# EAGLE schematic MGC3130_Board (EAGLE 6.3)

## Sheet 1 of 2
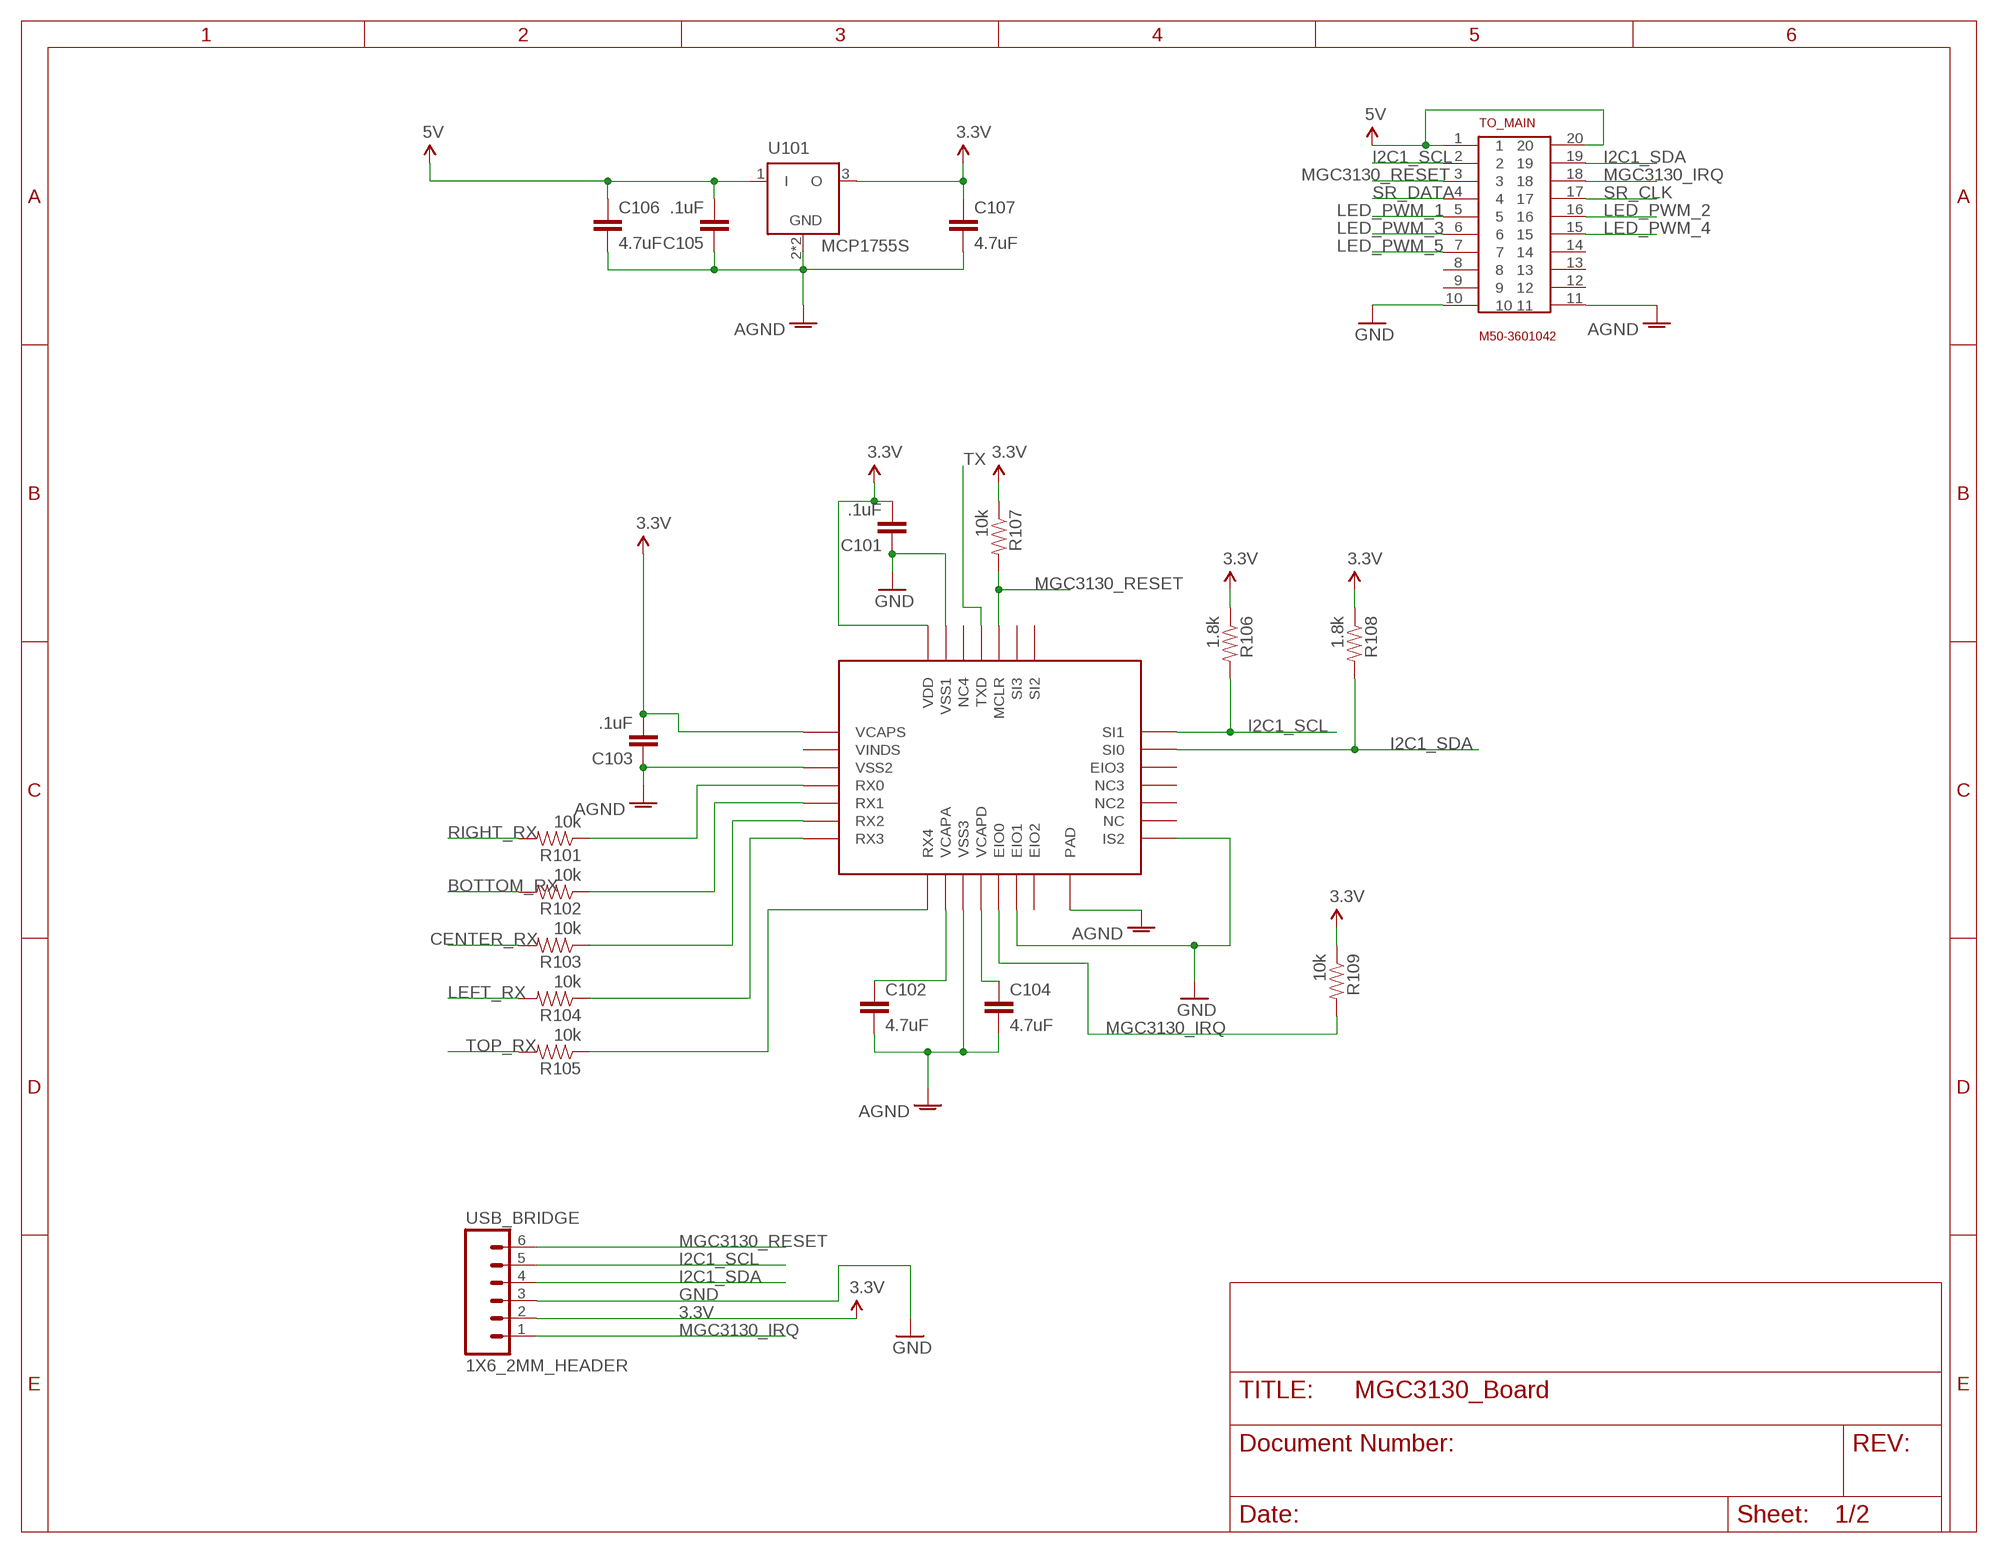
[diagram p0: schematic, sheet 1]

### Parts
C101  .1uF  CAP0402-CAP  [0402-CAP]
C102  4.7uF  CAP0805  [0805]
C103  .1uF  CAP0402-CAP  [0402-CAP]
C104  4.7uF  CAP0805  [0805]
C105  .1uF  CAP0402-CAP  [0402-CAP]
C106  4.7uF  CAP0805  [0805]
C107  4.7uF  CAP0805  [0805]
R101  10k  RESISTOR0402-RES  [0402-RES]
R102  10k  RESISTOR0402-RES  [0402-RES]
R103  10k  RESISTOR0402-RES  [0402-RES]
R104  10k  RESISTOR0402-RES  [0402-RES]
R105  10k  RESISTOR0402-RES  [0402-RES]
R106  1.8k  RESISTOR0402-RES  [0402-RES]
R107  10k  RESISTOR0402-RES  [0402-RES]
R108  1.8k  RESISTOR0402-RES  [0402-RES]
R109  10k  RESISTOR0402-RES  [0402-RES]
TO_MAIN  M50-3601042  [M50-3601042]
U101  MCP1755S  [SOT223]
U102  MGC3130  [QFN28]
USB_BRIDGE  1X6_2MM_HEADER  [1X6_2MM_HEADER]

### Nets
3.3V: C101.2 C103.2 C107.1 R106.1 R107.1 R108.1 R109.1 U101.3(O) U102.P$1(VCAPS) U102.P$28(VDD) USB_BRIDGE.2
5V: C105.2 C106.1 TO_MAIN.1 TO_MAIN.20 U101.1(I) ; also sheet 2
AGND: C102.2 C103.1 C104.2 C105.1 C106.2 C107.2 TO_MAIN.11 U101.2(GND) U101.4(GND) U102.P$3(VSS2) U102.P$10(VSS3) U102.P$29(PAD)
BOTTOM_RX: R102.2
CENTER_RX: R103.2
GND: C101.1 TO_MAIN.10 U102.P$13(EIO1) U102.P$15(IS2) U102.P$27(VSS1) USB_BRIDGE.3 ; also sheet 2
I2C1_SCL: R106.2 TO_MAIN.2 U102.P$21(SI1) USB_BRIDGE.5
I2C1_SDA: R108.2 TO_MAIN.19 U102.P$20(SI0) USB_BRIDGE.4
LED_PWM_1: TO_MAIN.5 ; also sheet 2
LED_PWM_2: TO_MAIN.16 ; also sheet 2
LED_PWM_3: TO_MAIN.6 ; also sheet 2
LED_PWM_4: TO_MAIN.15 ; also sheet 2
LED_PWM_5: TO_MAIN.7 ; also sheet 2
LEFT_RX: R104.2
MGC3130_IRQ: R109.2 TO_MAIN.18 U102.P$12(EIO0) USB_BRIDGE.1
MGC3130_RESET: R107.2 TO_MAIN.3 U102.P$24(MCLR) USB_BRIDGE.6
N$45: R101.1 U102.P$4(RX0)
N$46: R102.1 U102.P$5(RX1)
N$47: R103.1 U102.P$6(RX2)
N$48: R104.1 U102.P$7(RX3)
N$49: R105.1 U102.P$8(RX4)
N$50: C102.1 U102.P$9(VCAPA)
N$52: C104.1 U102.P$11(VCAPD)
RIGHT_RX: R101.2
SR_CLK: TO_MAIN.17 ; also sheet 2
SR_DATA: TO_MAIN.4 ; also sheet 2
TOP_RX: R105.2
TX: U102.P$25(TXD)
Unconnected: TO_MAIN.8 TO_MAIN.9 TO_MAIN.12 TO_MAIN.13 TO_MAIN.14 U102.P$2(VINDS) U102.P$14(EIO2) U102.P$16(NC) U102.P$17(NC2) U102.P$18(NC3) U102.P$19(EIO3) U102.P$22(SI2) U102.P$23(SI3) U102.P$26(NC4)

## Sheet 2 of 2
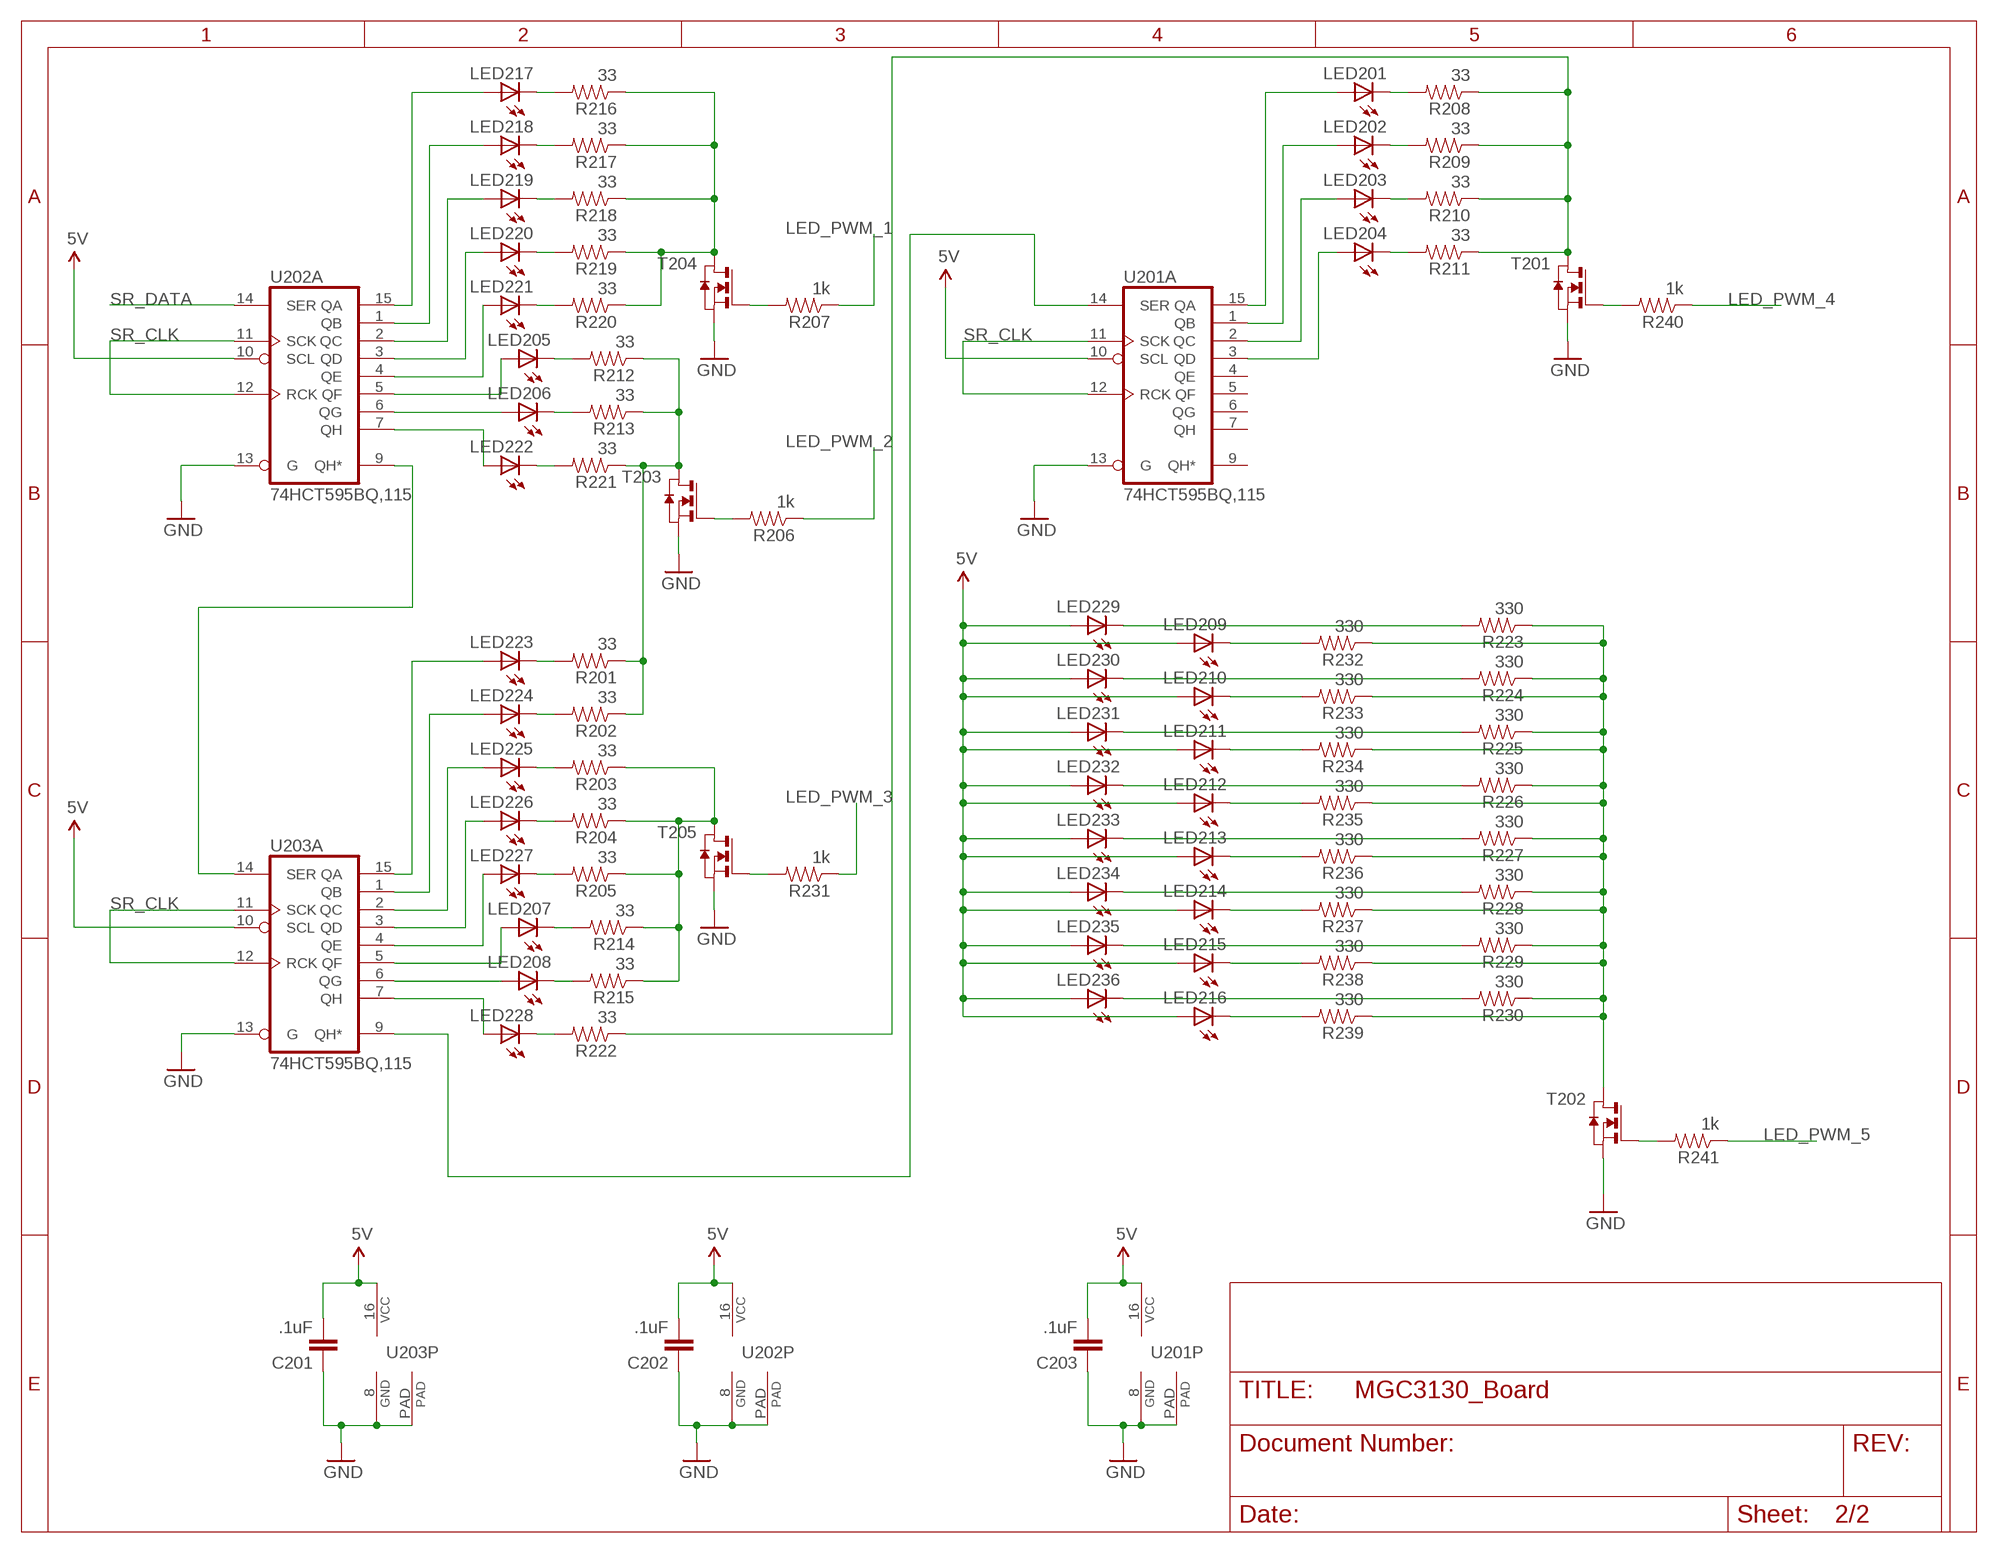
[diagram p1: schematic, sheet 2]

### Parts
C201  .1uF  CAP0402-CAP  [0402-CAP]
C202  .1uF  CAP0402-CAP  [0402-CAP]
C203  .1uF  CAP0402-CAP  [0402-CAP]
LED201  APA3010QBC/D-GX  [APA3010]
LED202  APA3010QBC/D-GX  [APA3010]
LED203  APA3010QBC/D-GX  [APA3010]
LED204  APA3010QBC/D-GX  [APA3010]
LED205  APA3010QBC/D-GX  [APA3010]
LED206  APA3010QBC/D-GX  [APA3010]
LED207  APA3010QBC/D-GX  [APA3010]
LED208  APA3010QBC/D-GX  [APA3010]
LED209  APA3010SRCPRV-GX  [APA3010]
LED210  APA3010SRCPRV-GX  [APA3010]
LED211  APA3010SRCPRV-GX  [APA3010]
LED212  APA3010SRCPRV-GX  [APA3010]
LED213  APA3010SRCPRV-GX  [APA3010]
LED214  APA3010SRCPRV-GX  [APA3010]
LED215  APA3010SRCPRV-GX  [APA3010]
LED216  APA3010SRCPRV-GX  [APA3010]
LED217  APA3010QBC/D-GX  [APA3010]
LED218  APA3010QBC/D-GX  [APA3010]
LED219  APA3010QBC/D-GX  [APA3010]
LED220  APA3010QBC/D-GX  [APA3010]
LED221  APA3010QBC/D-GX  [APA3010]
LED222  APA3010QBC/D-GX  [APA3010]
LED223  APA3010QBC/D-GX  [APA3010]
LED224  APA3010QBC/D-GX  [APA3010]
LED225  APA3010QBC/D-GX  [APA3010]
LED226  APA3010QBC/D-GX  [APA3010]
LED227  APA3010QBC/D-GX  [APA3010]
LED228  APA3010QBC/D-GX  [APA3010]
LED229  APA3010SRCPRV-GX  [APA3010]
LED230  APA3010SRCPRV-GX  [APA3010]
LED231  APA3010SRCPRV-GX  [APA3010]
LED232  APA3010SRCPRV-GX  [APA3010]
LED233  APA3010SRCPRV-GX  [APA3010]
LED234  APA3010SRCPRV-GX  [APA3010]
LED235  APA3010SRCPRV-GX  [APA3010]
LED236  APA3010SRCPRV-GX  [APA3010]
R201  33  RESISTOR0402-RES  [0402-RES]
R202  33  RESISTOR0402-RES  [0402-RES]
R203  33  RESISTOR0402-RES  [0402-RES]
R204  33  RESISTOR0402-RES  [0402-RES]
R205  33  RESISTOR0402-RES  [0402-RES]
R206  1k  RESISTOR0402-RES  [0402-RES]
R207  1k  RESISTOR0402-RES  [0402-RES]
R208  33  RESISTOR0402-RES  [0402-RES]
R209  33  RESISTOR0402-RES  [0402-RES]
R210  33  RESISTOR0402-RES  [0402-RES]
R211  33  RESISTOR0402-RES  [0402-RES]
R212  33  RESISTOR0402-RES  [0402-RES]
R213  33  RESISTOR0402-RES  [0402-RES]
R214  33  RESISTOR0402-RES  [0402-RES]
R215  33  RESISTOR0402-RES  [0402-RES]
R216  33  RESISTOR0402-RES  [0402-RES]
R217  33  RESISTOR0402-RES  [0402-RES]
R218  33  RESISTOR0402-RES  [0402-RES]
R219  33  RESISTOR0402-RES  [0402-RES]
R220  33  RESISTOR0402-RES  [0402-RES]
R221  33  RESISTOR0402-RES  [0402-RES]
R222  33  RESISTOR0402-RES  [0402-RES]
R223  330  RESISTOR0402-RES  [0402-RES]
R224  330  RESISTOR0402-RES  [0402-RES]
R225  330  RESISTOR0402-RES  [0402-RES]
R226  330  RESISTOR0402-RES  [0402-RES]
R227  330  RESISTOR0402-RES  [0402-RES]
R228  330  RESISTOR0402-RES  [0402-RES]
R229  330  RESISTOR0402-RES  [0402-RES]
R230  330  RESISTOR0402-RES  [0402-RES]
R231  1k  RESISTOR0402-RES  [0402-RES]
R232  330  RESISTOR0402-RES  [0402-RES]
R233  330  RESISTOR0402-RES  [0402-RES]
R234  330  RESISTOR0402-RES  [0402-RES]
R235  330  RESISTOR0402-RES  [0402-RES]
R236  330  RESISTOR0402-RES  [0402-RES]
R237  330  RESISTOR0402-RES  [0402-RES]
R238  330  RESISTOR0402-RES  [0402-RES]
R239  330  RESISTOR0402-RES  [0402-RES]
R240  1k  RESISTOR0603-RES  [0603-RES]
R241  1k  RESISTOR0402-RES  [0402-RES]
T201  NMOSSOT23  [SOT-23]
T202  NMOSSOT23  [SOT-23]
T203  NMOSSOT23  [SOT-23]
T204  NMOSSOT23  [SOT-23]
T205  NMOSSOT23  [SOT-23]
U201  74HCT595BQ,115  [DHVQFN16]
U202  74HCT595BQ,115  [DHVQFN16]
U203  74HCT595BQ,115  [DHVQFN16]

### Nets
5V: C201.2 C202.2 C203.2 LED209.P$2(A) LED210.P$2(A) LED211.P$2(A) LED212.P$2(A) LED213.P$2(A) LED214.P$2(A) LED215.P$2(A) LED216.P$2(A) LED229.P$2(A) LED230.P$2(A) LED231.P$2(A) LED232.P$2(A) LED233.P$2(A) LED234.P$2(A) LED235.P$2(A) LED236.P$2(A) U201.10(A:SCL) U201.16(P:VCC) U202.10(A:SCL) U202.16(P:VCC) U203.10(A:SCL) U203.16(P:VCC) ; also sheet 1
GND: C201.1 C202.1 C203.1 T201.2(S) T202.2(S) T203.2(S) T204.2(S) T205.2(S) U201.8(P:GND) U201.13(A:G) U201.PAD(P:GND1) U202.8(P:GND) U202.13(A:G) U202.PAD(P:GND1) U203.8(P:GND) U203.13(A:G) U203.PAD(P:GND1) ; also sheet 1
LED_PWM_1: R207.1 ; also sheet 1
LED_PWM_2: R206.1 ; also sheet 1
LED_PWM_3: R231.1 ; also sheet 1
LED_PWM_4: R240.1 ; also sheet 1
LED_PWM_5: R241.1 ; also sheet 1
N$1: LED229.P$1(C) R223.2
N$2: LED209.P$1(C) R232.2
N$3: LED230.P$1(C) R224.2
N$4: LED210.P$1(C) R233.2
N$5: LED231.P$1(C) R225.2
N$6: LED208.P$2(A) U203.6(A:QG)
N$8: LED211.P$1(C) R234.2
N$9: LED232.P$1(C) R226.2
N$10: LED212.P$1(C) R235.2
N$11: LED234.P$1(C) R228.2
N$12: LED233.P$1(C) R227.2
N$13: LED213.P$1(C) R236.2
N$14: LED214.P$1(C) R237.2
N$15: LED235.P$1(C) R229.2
N$16: LED215.P$1(C) R238.2
N$17: R207.2 T204.3(G)
N$18: LED236.P$1(C) R230.2
N$19: LED216.P$1(C) R239.2
N$51: LED217.P$2(A) U202.15(A:QA)
N$53: LED218.P$2(A) U202.1(A:QB)
N$54: LED219.P$2(A) U202.2(A:QC)
N$55: LED220.P$2(A) U202.3(A:QD)
N$56: LED221.P$2(A) U202.4(A:QE)
N$57: LED205.P$2(A) U202.5(A:QF)
N$58: LED206.P$2(A) U202.6(A:QG)
N$59: LED222.P$2(A) U202.7(A:QH)
N$60: LED217.P$1(C) R216.2
N$61: LED218.P$1(C) R217.2
N$62: LED219.P$1(C) R218.2
N$63: LED220.P$1(C) R219.2
N$64: LED221.P$1(C) R220.2
N$65: LED205.P$1(C) R212.2
N$66: LED206.P$1(C) R213.2
N$67: LED222.P$1(C) R221.2
N$68: R216.1 R217.1 R218.1 R219.1 R220.1 T204.1(D)
N$69: R201.1 R202.1 R212.1 R213.1 R221.1 T203.1(D)
N$70: LED223.P$2(A) U203.15(A:QA)
N$71: LED224.P$2(A) U203.1(A:QB)
N$72: LED225.P$2(A) U203.2(A:QC)
N$73: LED226.P$2(A) U203.3(A:QD)
N$74: LED227.P$2(A) U203.4(A:QE)
N$75: LED207.P$2(A) U203.5(A:QF)
N$77: LED228.P$2(A) U203.7(A:QH)
N$78: LED223.P$1(C) R201.2
N$79: LED224.P$1(C) R202.2
N$80: LED225.P$1(C) R203.2
N$81: LED226.P$1(C) R204.2
N$82: LED227.P$1(C) R205.2
N$83: LED207.P$1(C) R214.2
N$84: LED208.P$1(C) R215.2
N$85: LED228.P$1(C) R222.2
N$87: R203.1 R204.1 R205.1 R214.1 R215.1 T205.1(D)
N$88: LED201.P$2(A) U201.15(A:QA)
N$89: LED202.P$2(A) U201.1(A:QB)
N$90: LED203.P$2(A) U201.2(A:QC)
N$91: LED204.P$2(A) U201.3(A:QD)
N$92: R223.1 R224.1 R225.1 R226.1 R227.1 R228.1 R229.1 R230.1 R232.1 R233.1 R234.1 R235.1 R236.1 R237.1 R238.1 R239.1 T202.1(D)
N$93: U202.9(A:QH*) U203.14(A:SER)
N$96: LED201.P$1(C) R208.2
N$97: LED202.P$1(C) R209.2
N$98: LED203.P$1(C) R210.2
N$99: LED204.P$1(C) R211.2
N$104: R208.1 R209.1 R210.1 R211.1 R222.1 T201.1(D)
N$115: U201.14(A:SER) U203.9(A:QH*)
N$118: R206.2 T203.3(G)
N$120: R231.2 T205.3(G)
N$121: R240.2 T201.3(G)
N$122: R241.2 T202.3(G)
SR_CLK: U201.11(A:SCK) U201.12(A:RCK) U202.11(A:SCK) U202.12(A:RCK) U203.11(A:SCK) U203.12(A:RCK) ; also sheet 1
SR_DATA: U202.14(A:SER) ; also sheet 1
Unconnected: U201.4(A:QE) U201.5(A:QF) U201.6(A:QG) U201.7(A:QH) U201.9(A:QH*)

## Library data of the parts
C101-C107 C201-C203 = SparkFun-Passives:CAP: Capacitor Standard 0603 ceramic capacitor, and 0.1" leaded capacitor.
LED201-LED208 LED217-LED228 = HackMe:APA3010QBC/D-GX
LED209-LED216 LED229-LED236 = HackMe:APA3010SRCPRV-GX: Kingbright Right Angle Red SMT LED
R101-R109 R201-R241 = SparkFun-Passives:RESISTOR: Resistor Basic schematic elements and footprints for 0603, 1206, and PTH resistors.
T201-T205 = zetex:NMOSSOT23: MOS FET; OC_FARNELL: unknown; OC_NEWARK: unknown
TO_MAIN = HackMe:M50-3601042
U101 = HackMe:MCP1755S
U102 = HackMe:MGC3130
U201-U203 = HackMe:74HCT595BQ,115: Shift Register DHVQFN16
USB_BRIDGE = HackMe:1X6_2MM_HEADER